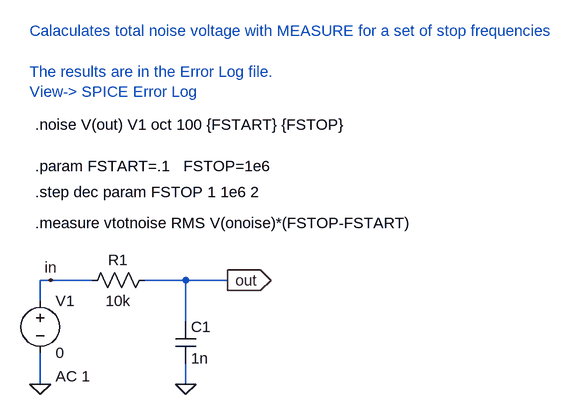
[diagram p0: schematic rc_total_noise_sweep.asc]
rc_total_noise_sweep.asc, the LTspice schematic file:
Version 4
SHEET 1 880 680
WIRE -48 176 -64 176
WIRE 16 176 -48 176
WIRE 160 176 96 176
WIRE 224 176 160 176
WIRE -64 208 -64 176
WIRE 160 240 160 176
WIRE -64 336 -64 288
WIRE 160 336 160 304
FLAG -64 336 0
FLAG 160 336 0
FLAG 224 176 out
IOPIN 224 176 Out
FLAG -48 176 in
SYMBOL res 0 192 R270
WINDOW 0 32 56 VTop 0
WINDOW 3 0 56 VBottom 0
SYMATTR InstName R1
SYMATTR Value 10k
SYMBOL cap 144 240 R0
SYMATTR InstName C1
SYMATTR Value 1n
SYMBOL voltage -64 192 R0
WINDOW 123 24 132 Left 0
WINDOW 39 0 0 Left 0
SYMATTR InstName V1
SYMATTR Value 0
SYMATTR Value2 AC 1
TEXT -72 -64 Left 0 !.noise V(out) V1 oct 100 {FSTART} {FSTOP}
TEXT -72 88 Left 0 !.measure vtotnoise RMS V(onoise)*(FSTOP-FSTART)
TEXT -72 0 Left 0 !.param FSTART=.1   FSTOP=1e6
TEXT -72 40 Left 0 !.step dec param FSTOP 1 1e6 2
TEXT -80 -208 Left 0 ;Calaculates total noise voltage with MEASURE for a set of stop frequencies\n \nThe results are in the Error Log file.\nView-> SPICE Error Log

The netlist it stands for:
* rc_total_noise_sweep.asc
R1 in out 10k
C1 out 0 1n
V1 in 0 0 AC 1
.noise V(out) V1 oct 100 {FSTART} {FSTOP}
.measure vtotnoise RMS V(onoise)*(FSTOP-FSTART)
.param FSTART=.1   FSTOP=1e6
.step dec param FSTOP 1 1e6 2
* Calaculates total noise voltage with MEASURE for a set of stop frequencies
* The results are in the Error Log file.
* View-> SPICE Error Log
.backanno
.end